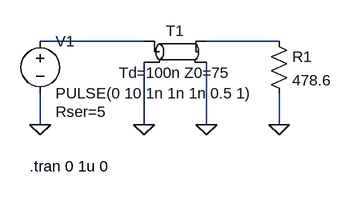
[diagram p0: schematic EC1_2a.asc]
EC1_2a.asc, the LTspice schematic file:
Version 4
SHEET 1 880 680
WIRE 128 128 -32 128
WIRE 336 128 224 128
WIRE -32 256 -32 208
WIRE 128 256 128 160
WIRE 224 256 224 160
WIRE 336 256 336 208
FLAG -32 256 0
FLAG 128 256 0
FLAG 224 256 0
FLAG 336 256 0
SYMBOL tline 176 144 R0
SYMATTR InstName T1
SYMATTR Value Td=100n Z0=75
SYMBOL res 320 112 R0
SYMATTR InstName R1
SYMATTR Value 478.6
SYMBOL voltage -32 112 R0
WINDOW 123 0 0 Left 0
WINDOW 39 24 124 Left 2
SYMATTR InstName V1
SYMATTR Value PULSE(0 10 1n 1n 1n 0.5 1)
SYMATTR SpiceLine Rser=5
TEXT -48 320 Left 2 !.tran 0 1u 0

The netlist it stands for:
* EC1_2a.asc
T1 N001 0 N002 0 Td=100n Z0=75
R1 N002 0 478.6
V1 N001 0 PULSE(0 10 1n 1n 1n 0.5 1) Rser=5
.tran 0 1u 0
.backanno
.end